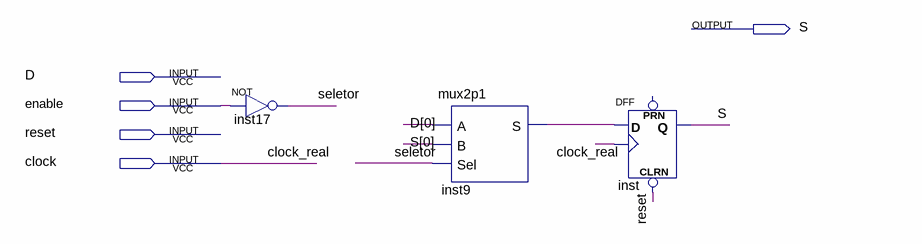
[diagram p0: schematic sheet]
// Quartus schematic register1b.bdf as structural Verilog: 3 symbols, 5 pins
module register1b (
  input  D,
  input  enable,
  input  reset,
  input  clock,
  output S
);

  wire inst9_s, seletor;
  wire [0:0] D_bus, S_bus;

  not inst17 (seletor, enable);
  mux2p1 inst9 (.A(D_bus[0]), .B(S_bus[0]), .Sel(seletor), .S(inst9_s));
  DFF inst (.CLRN(reset), .CLK(clock), .D(inst9_s), .Q(S));  // open: PRN

  // Other names for the same wires on the sheet: clock_real = clock
endmodule
